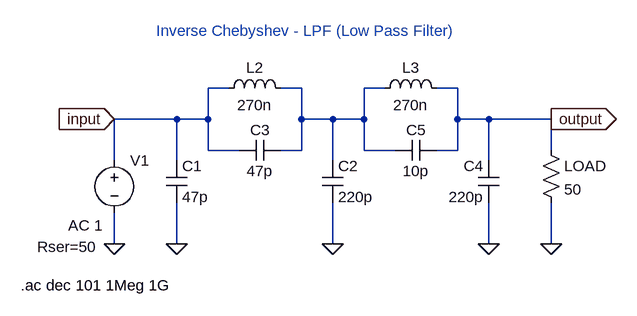
[diagram p0: schematic lpf-inverse-chebyshev.asc]
lpf-inverse-chebyshev.asc, the LTspice schematic file:
Version 4.1
SHEET 1 1080 680
WIRE 288 48 256 48
WIRE 400 48 368 48
WIRE 528 48 496 48
WIRE 640 48 608 48
WIRE 208 96 112 96
WIRE 256 96 256 48
WIRE 256 96 208 96
WIRE 400 96 400 48
WIRE 448 96 400 96
WIRE 496 96 496 48
WIRE 496 96 448 96
WIRE 640 96 640 48
WIRE 688 96 640 96
WIRE 784 96 688 96
WIRE 256 144 256 96
WIRE 304 144 256 144
WIRE 400 144 400 96
WIRE 400 144 368 144
WIRE 496 144 496 96
WIRE 544 144 496 144
WIRE 640 144 640 96
WIRE 640 144 608 144
WIRE 784 144 784 96
WIRE 112 160 112 96
WIRE 208 160 208 96
WIRE 448 160 448 96
WIRE 688 160 688 96
WIRE 112 288 112 240
WIRE 208 288 208 224
WIRE 448 288 448 224
WIRE 688 288 688 224
WIRE 784 288 784 224
FLAG 448 288 0
FLAG 784 288 0
FLAG 112 288 0
FLAG 208 288 0
FLAG 688 288 0
FLAG 112 96 input
IOPIN 112 96 In
FLAG 784 96 output
IOPIN 784 96 Out
SYMBOL cap 192 160 R0
SYMATTR InstName C1
SYMATTR Value 47p
SYMBOL cap 432 160 R0
SYMATTR InstName C2
SYMATTR Value 220p
SYMBOL cap 368 128 R90
WINDOW 0 0 32 VBottom 2
WINDOW 3 32 32 VTop 2
SYMATTR InstName C3
SYMATTR Value 47p
SYMBOL cap 704 224 R180
WINDOW 0 24 56 Left 2
WINDOW 3 24 8 Left 2
SYMATTR InstName C4
SYMATTR Value 220p
SYMBOL cap 544 160 R270
WINDOW 0 32 32 VTop 2
WINDOW 3 0 32 VBottom 2
SYMATTR InstName C5
SYMATTR Value 10p
SYMBOL ind 272 64 R270
WINDOW 0 32 56 VTop 2
WINDOW 3 5 56 VBottom 2
SYMATTR InstName L2
SYMATTR Value 270n
SYMBOL ind 512 64 R270
WINDOW 0 32 56 VTop 2
WINDOW 3 5 56 VBottom 2
SYMATTR InstName L3
SYMATTR Value 270n
SYMBOL res 768 128 R0
SYMATTR InstName LOAD
SYMATTR Value 50
SYMBOL voltage 112 144 R0
WINDOW 123 -71 116 Left 2
WINDOW 39 -119 149 Left 2
SYMATTR Value2 AC 1
SYMATTR SpiceLine Rser=50
SYMATTR InstName V1
SYMATTR Value ""
TEXT -32 352 Left 2 !.ac dec 101 1Meg 1G
TEXT 176 -40 Left 2 ;Inverse Chebyshev - LPF (Low Pass Filter)

The netlist it stands for:
* lpf-inverse-chebyshev.asc
C1 input 0 47p
C2 N001 0 220p
C3 N001 input 47p
C4 0 output 220p
C5 N001 output 10p
L2 input N001 270n
L3 N001 output 270n
R§LOAD output 0 50
V1 input 0 AC 1 Rser=50
.ac dec 101 1Meg 1G
* Inverse Chebyshev - LPF (Low Pass Filter)
.backanno
.end